# EAGLE design XNOR gate (EAGLE 6.1)
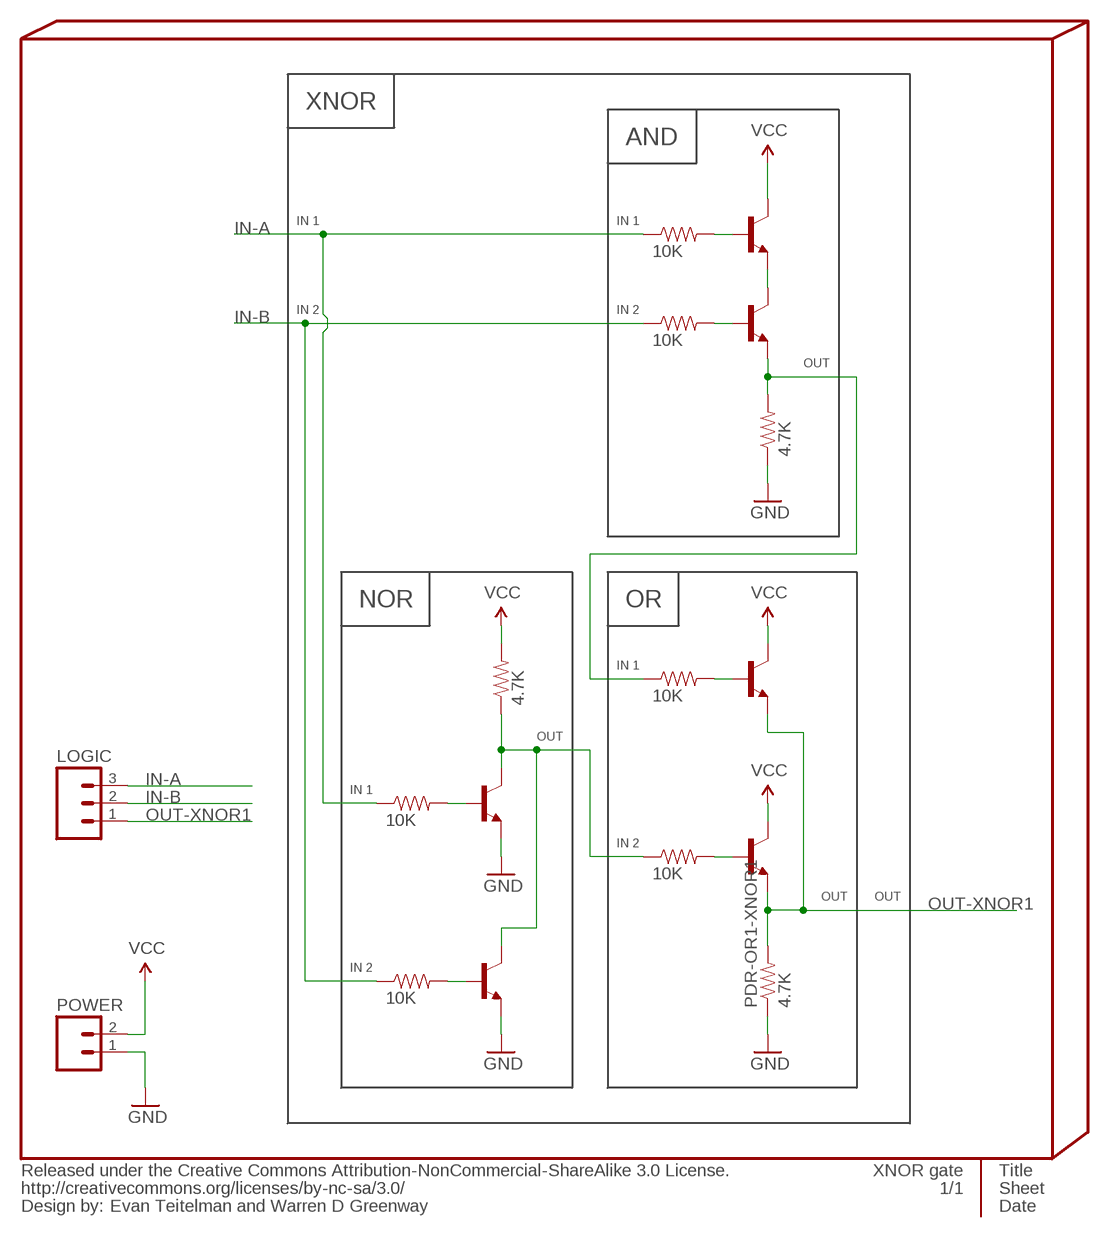
[diagram p0: schematic, sheet 1]

## Parts
INFO4  Evan Teitelman and Warren D Greenway  %CC-NC-SA  [%CC-NC-SA]
LOGIC  M03PTH  [1X03]
PDR-AND1-XNOR1  4.7K  RESISTOR0402-RES  [0402-RES]
PDR-OR1-XNOR1  4.7K  RESISTOR0402-RES  [0402-RES]
POWER  M02PTH  [1X02]
PUR-NOR1-XNOR1  4.7K  RESISTOR0402-RES  [0402-RES]
Q1-AND1-XNOR1  TRANSISTOR_NPNSOT23  [SOT23]
Q1-NOR1-XNOR1  TRANSISTOR_NPNSOT23  [SOT23]
Q1-OR1-XNOR1  TRANSISTOR_NPNSOT23  [SOT23]
Q2-AND1-XNOR1  TRANSISTOR_NPNSOT23  [SOT23]
Q2-NOR1-XNOR1  TRANSISTOR_NPNSOT23  [SOT23]
Q2-OR1-XNOR1  TRANSISTOR_NPNSOT23  [SOT23]
R1-AND1-XNOR1  10K  RESISTOR0402-RES  [0402-RES]
R1-NOR1-XNOR1  10K  RESISTOR0402-RES  [0402-RES]
R1-OR1-XNOR1  10K  RESISTOR0402-RES  [0402-RES]
R2-AND1-XNOR1  10K  RESISTOR0402-RES  [0402-RES]
R2-NOR1-XNOR1  10K  RESISTOR0402-RES  [0402-RES]
R2-OR1-XNOR1  10K  RESISTOR0402-RES  [0402-RES]

## Nets
GND: PDR-AND1-XNOR1.1 PDR-OR1-XNOR1.1 POWER.1 Q1-NOR1-XNOR1.2(E) Q2-NOR1-XNOR1.2(E) ; supply symbol labelled @GND
IN-A: LOGIC.3 R1-AND1-XNOR1.1 R1-NOR1-XNOR1.1
IN-B: LOGIC.2 R2-AND1-XNOR1.1 R2-NOR1-XNOR1.1
N$3: Q1-NOR1-XNOR1.1(B) R1-NOR1-XNOR1.2
N$6: Q2-NOR1-XNOR1.1(B) R2-NOR1-XNOR1.2
N$7: Q1-AND1-XNOR1.1(B) R1-AND1-XNOR1.2
N$8: Q2-AND1-XNOR1.1(B) R2-AND1-XNOR1.2
N$10: Q2-OR1-XNOR1.1(B) R2-OR1-XNOR1.2
N$11: Q1-OR1-XNOR1.1(B) R1-OR1-XNOR1.2
OUT-AND1-XNOR1: PDR-AND1-XNOR1.2 Q2-AND1-XNOR1.2(E) R1-OR1-XNOR1.1
OUT-NOR1-XNOR1: PUR-NOR1-XNOR1.1 Q1-NOR1-XNOR1.3(C) Q2-NOR1-XNOR1.3(C) R2-OR1-XNOR1.1
OUT-XNOR1: LOGIC.1 PDR-OR1-XNOR1.2 Q1-OR1-XNOR1.2(E) Q2-OR1-XNOR1.2(E)
Q-Q-AND1-XNOR1: Q1-AND1-XNOR1.2(E) Q2-AND1-XNOR1.3(C)
VCC: POWER.2 PUR-NOR1-XNOR1.2 Q1-AND1-XNOR1.3(C) Q1-OR1-XNOR1.3(C) Q2-OR1-XNOR1.3(C) ; supply symbol labelled @VCC

## Notes on the sheet
- XNOR
- AND
- IN 1 | IN 1
- IN 2 | IN 2
- OUT
- NOR | OR
- IN 1
- OUT
- IN 1
- IN 2
- OUT | OUT
- IN 2

## Library data of the parts
INFO4 = PygmyBoards:%CC-NC-SA: Released under the Creative Commons Attribution-NonCommercial-ShareAlike 3.0 License. http://creativecommons.org/licenses/by-sa/3.0 Design by: [Designer Name] Change this part's value to change the designer name
LOGIC = SparkFun:M03: Header 3 Standard 3-pin 0.1" header. Use with straight break away headers (SKU : PRT-00116), right angle break away headers (PRT-00553), swiss pins (PRT-00743), machine pins (PRT-00117), and female headers (PRT-00115). Molex polarized connector foot print use with SKU : PRT-08232 with associated crimp pins and housings.
PDR-AND1-XNOR1 PDR-OR1-XNOR1 PUR-NOR1-XNOR1 R1-AND1-XNOR1 R1-NOR1-XNOR1 R1-OR1-XNOR1 R2-AND1-XNOR1 R2-NOR1-XNOR1 R2-OR1-XNOR1 = SparkFun:RESISTOR: Resistor Basic schematic elements and footprints for 0603, 1206, and PTH resistors.
POWER = SparkFun:M02: Header 2 Standard 2-pin 0.1" header. Use with straight break away headers (SKU : PRT-00116), right angle break away headers (PRT-00553), swiss pins (PRT-00743), machine pins (PRT-00117), and female headers (PRT-00115). Molex polarized connector foot print use with SKU : PRT-08233 with associated crimp pins and housings.
Q1-AND1-XNOR1 Q1-NOR1-XNOR1 Q1-OR1-XNOR1 Q2-AND1-XNOR1 Q2-NOR1-XNOR1 Q2-OR1-XNOR1 = SparkFun:TRANSISTOR_NPN: Transistor NPN BJT configuration in SOT23 package. MMBT2222 is the common NPN we use. Double check BCE configuration again layout.

## Board
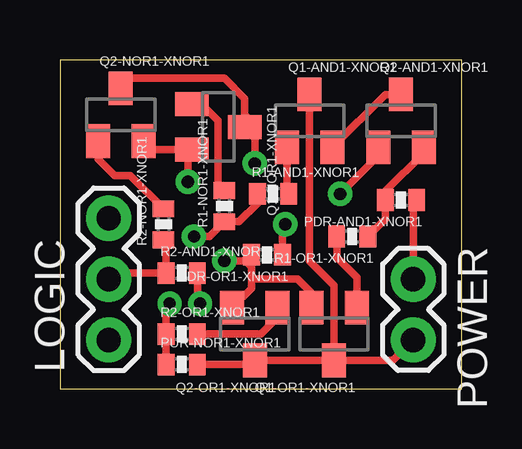
[diagram p1: board, top side]
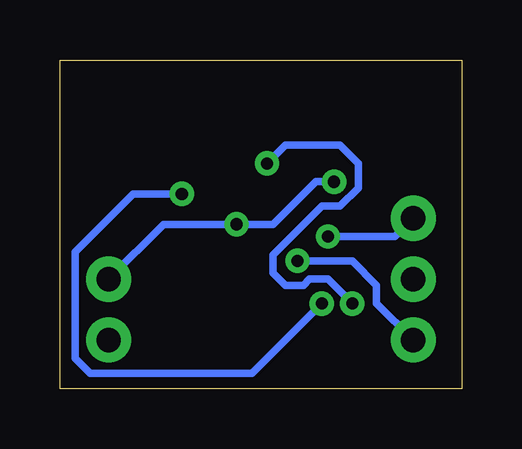
[diagram p2: board, bottom side, seen from below]

Size 16.76 x 13.72 mm. Coordinates in mm from the lower left corner, seen from the top.
Outline: 0,0 16.76,0 16.76,13.72 0,13.72 0,0
Copper layers (1*16): Top 0.035mm / dielectric 1.5mm / Bottom 0.035mm
Design rules: minimum track width 8mil, minimum drill 20mil, track to track 8mil, track to pad 8mil, pad to pad 4mil, via to via 8mil, smd to smd 4mil, copper to edge 15mil, drill to drill 8mil, minimum pad ring 12mil, minimum via ring 10mil, stop-mask expansion 4mil, vias tented up to drill 25mil, thermal gap 10mil

### Footprints (pad centres in the part's own frame; a part is rotated, then mirrored left to right if it is on the bottom)
1X03 = drill 1.016 pad 1.88: 1 0,0; 2 2.54,0; 3 5.08,0
0402-RES = smd 0.7 x 0.9: 1 -0.65,0; 2 0.65,0
1X02 = drill 1.016 pad 1.88: 1 0,0; 2 2.54,0
SOT23 = smd 1 x 1.4: 1 -0.95,-1.1; 2 0.95,-1.1; 3 0,1.1

### Placement (x,y rotation side)
INFO4  0,-7.62 0 top  (outside the outline)
LOGIC  2.03,2.03 90 top
PDR-AND1-XNOR1  14.22,7.87 180 top
PDR-OR1-XNOR1  8.64,5.59 180 top
POWER  14.73,4.57 270 top
PUR-NOR1-XNOR1  5.08,1.02 0 top
Q1-AND1-XNOR1  10.41,11.18 0 top
Q1-NOR1-XNOR1  6.6,10.92 270 top
Q1-OR1-XNOR1  11.43,2.29 180 top
Q2-AND1-XNOR1  14.22,11.18 0 top
Q2-NOR1-XNOR1  2.54,11.43 0 top
Q2-OR1-XNOR1  8.13,2.29 180 top
R1-AND1-XNOR1  8.89,8.13 0 top
R1-NOR1-XNOR1  6.86,7.62 90 top
R1-OR1-XNOR1  12.19,6.35 180 top
R2-AND1-XNOR1  5.08,4.83 0 top
R2-NOR1-XNOR1  4.32,6.86 90 top
R2-OR1-XNOR1  5.08,2.29 0 top

### Tracks (layer width: path | path; a pad name or v marks a point on that pad's centre or on a via)
GND  (via drill 0.51)
  Top 0.305: Q1-NOR1-XNOR1.2 5.4,10.08 | POWER.1 14.73,7.73 PDR-AND1-XNOR1.1 | v9.4,6.86 9.29,6.75 PDR-OR1-XNOR1.1 | Q1-NOR1-XNOR1.2 5.33,9.8 v5.33,8.64 | Q2-NOR1-XNOR1.2 3.85,9.97 Q1-NOR1-XNOR1.2
  Bottom 0.305: POWER.1 12.45,6.86 v9.4,6.86 7.87,6.86 6.1,8.64 v5.33,8.64
IN-A  (via drill 0.51)
  Top 0.305: v5.59,6.35 6.24,6.35 R1-NOR1-XNOR1.1 7.48,6.97 8.24,7.73 R1-AND1-XNOR1.1
  Bottom 0.305: v5.59,6.35 2.79,6.35 LOGIC.3
IN-B
  Top 0.305: LOGIC.2 2.29,4.83 R2-AND1-XNOR1.1 4.43,6.1 R2-NOR1-XNOR1.1
N$3
  Top 0.305: Q1-NOR1-XNOR1.1 5.91,11.87 6.6,11.18 6.6,8.52 R1-NOR1-XNOR1.2
N$6
  Top 0.305: Q2-NOR1-XNOR1.1 1.59,9.59 2.29,8.89 2.94,8.89 R2-NOR1-XNOR1.2
N$7
  Top 0.305: Q1-AND1-XNOR1.1 9.46,8.2 R1-AND1-XNOR1.2
N$8  (via drill 0.51)
  Top 0.305: Q2-AND1-XNOR1.1 13.27,9.72 v11.68,8.13 | v5.84,3.56 5.73,3.67 R2-AND1-XNOR1.2
  Bottom 0.305: v11.68,8.13 13.72,8.13 16.13,5.71 16.13,1.27 15.49,0.64 8.76,0.64 v5.84,3.56
N$10
  Top 0.305: R2-OR1-XNOR1.2 8.38,2.29 9.08,2.98 Q2-OR1-XNOR1.1
N$11
  Top 0.305: Q1-OR1-XNOR1.1 12.38,4.64 11.54,5.48 R1-OR1-XNOR1.2
OUT-AND1-XNOR1
  Top 0.305: R1-OR1-XNOR1.1 13.57,7.08 PDR-AND1-XNOR1.2 13.57,8.24 15.17,9.84 Q2-AND1-XNOR1.2
OUT-NOR1-XNOR1  (via drill 0.51)
  Top 0.305: Q2-NOR1-XNOR1.3 2.96,12.95 6.86,12.95 7.7,12.11 7.7,11.43 | 7.7,11.43 Q1-NOR1-XNOR1.3 | PUR-NOR1-XNOR1.1 R2-OR1-XNOR1.1 4.43,3.41 v4.57,3.56 | v8.13,9.4 8.13,11.01 7.7,11.43
  Bottom 0.305: v8.13,9.4 7.37,10.16 5.08,10.16 4.32,9.4 4.32,8.38 5.08,7.62 5.84,7.62 7.87,5.59 7.87,4.83 7.37,4.32 6.6,4.32 6.35,4.57 5.59,4.57 v4.57,3.56
OUT-XNOR1  (via drill 0.51)
  Top 0.305: Q2-OR1-XNOR1.2 7.99,4.19 7.99,4.57 | 7.99,5.08 7.99,4.57 | 7.99,5.08 PDR-OR1-XNOR1.2 | Q1-OR1-XNOR1.2 10.48,4 9.91,4.57 7.99,4.57 | v6.86,5.33 7.73,5.33 7.99,5.08
  Bottom 0.305: v6.86,5.33 4.57,5.33 3.56,4.32 3.56,3.56 LOGIC.1
Q-Q-AND1-XNOR1
  Top 0.305: Q1-AND1-XNOR1.2 13.56,12.28 Q2-AND1-XNOR1.3
VCC
  Top 0.305: Q1-OR1-XNOR1.3 Q2-OR1-XNOR1.3 7.96,1.02 PUR-NOR1-XNOR1.2 | Q1-OR1-XNOR1.3 13.89,1.19 POWER.2 | Q1-AND1-XNOR1.3 10.41,5.33 11.43,4.32 Q1-OR1-XNOR1.3

### Text on the board
_bsilk: AND | Out | In-B | Gnd | In-A | Vcc